# EAGLE design bldc (EAGLE 6.4)
Assembly variants: IRLR8726PBF
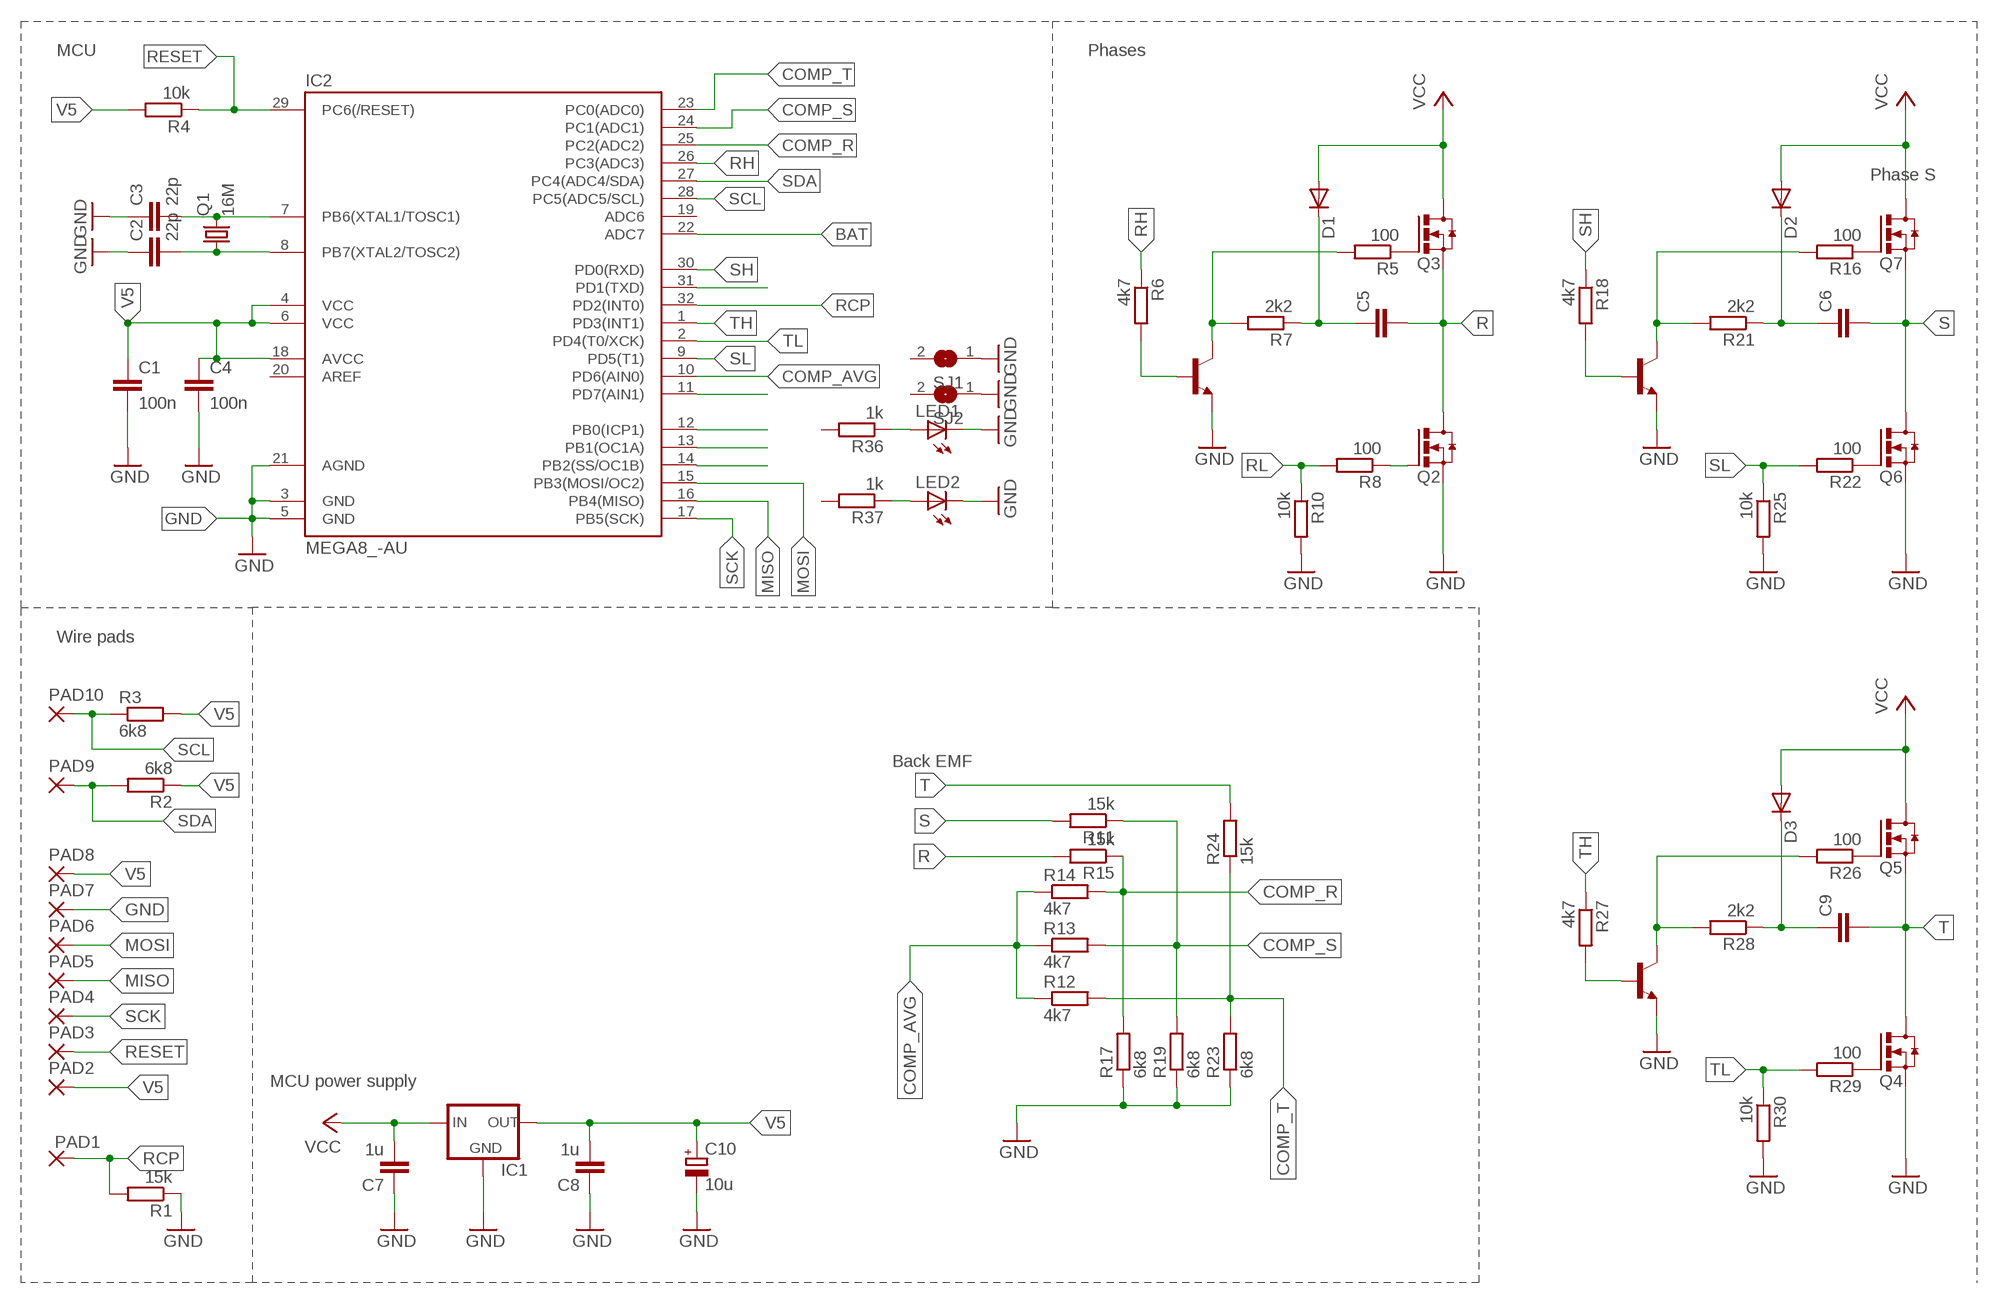
[diagram p0: schematic, sheet 1]

## Parts
C1  100n  C-EUC0805K  [C0805K]
C2  22p  C-EUC0805K  [C0805K]
C3  22p  C-EUC0805K  [C0805K]
C4  100n  C-EUC0805K  [C0805K]
C5  C-EUC1206K  [C1206K]
C6  C-EUC1206K  [C1206K]
C7  1u  C-EUC0805K  [C0805K]
C8  1u  C-EUC0805K  [C0805K]
C9  C-EUC1206K  [C1206K]
C10  10u  CPOL-EUE2.5-4V  [E2,5RE]
D1  1N4148SOD-80  [C1206K]
D2  1N4148SOD-80  [C1206K]
D3  1N4148SOD-80  [C1206K]
IC1  LM1117TO252  [TO252]
IC2  MEGA8_-AU  [TQFP32-08]
LED1  LEDCHIPLED_0805  [CHIPLED_0805]
LED2  LEDCHIPLED_0805  [CHIPLED_0805]
PAD1  WIREPADSMD1,27-254  [SMD1,27-2,54]
PAD2  WIREPADSMD1,27-254  [SMD1,27-2,54]
PAD3  WIREPADSMD1,27-254  [SMD1,27-2,54]
PAD4  WIREPADSMD1,27-254  [SMD1,27-2,54]
PAD5  WIREPADSMD1,27-254  [SMD1,27-2,54]
PAD6  WIREPADSMD1,27-254  [SMD1,27-2,54]
PAD7  WIREPADSMD1,27-254  [SMD1,27-2,54]
PAD8  WIREPADSMD1,27-254  [SMD1,27-2,54]
PAD9  WIREPADSMD1,27-254  [SMD1,27-2,54]
PAD10  WIREPADSMD1,27-254  [SMD1,27-2,54]
Q1  16M  CRYSTALSM49  [SM49]
Q2  IRFR1205  [D-PAK_TO252AA]
Q3  IRFR1205  [D-PAK_TO252AA]
Q4  IRFR1205  [D-PAK_TO252AA]
Q5  IRFR1205  [D-PAK_TO252AA]
Q6  IRFR1205  [D-PAK_TO252AA]
Q7  IRFR1205  [D-PAK_TO252AA]
R1  15k  R-EU_R0603  [R0603]
R2  6k8  R-EU_R0603  [R0603]
R3  6k8  R-EU_R0603  [R0603]
R4  10k  R-EU_R0603  [R0603]
R5  100  R-EU_R0603  [R0603]
R6  4k7  R-EU_R0603  [R0603]
R7  2k2  R-EU_R0603  [R0603]
R8  100  R-EU_R0603  [R0603]
R10  10k  R-EU_R0603  [R0603]
R11  15k  R-EU_R0603  [R0603]
R12  4k7  R-EU_R0603  [R0603]
R13  4k7  R-EU_R0603  [R0603]
R14  4k7  R-EU_R0603  [R0603]
R15  15k  R-EU_R0805  [R0805]
R16  100  R-EU_R0603  [R0603]
R17  6k8  R-EU_R0603  [R0603]
R18  4k7  R-EU_R0603  [R0603]
R19  6k8  R-EU_R0603  [R0603]
R21  2k2  R-EU_R0603  [R0603]
R22  100  R-EU_R0603  [R0603]
R23  6k8  R-EU_R0603  [R0603]
R24  15k  R-EU_R0603  [R0603]
R25  10k  R-EU_R0603  [R0603]
R26  100  R-EU_R0603  [R0603]
R27  4k7  R-EU_R0603  [R0603]
R28  2k2  R-EU_R0603  [R0603]
R29  100  R-EU_R0603  [R0603]
R30  10k  R-EU_R0603  [R0603]
R36  1k  R-EU_R0603  [R0603]
R37  1k  R-EU_R0603  [R0603]
SJ1  SJ  [SJ]
SJ2  SJ  [SJ]
T1  BC847  [SOT23]
T2  BC847  [SOT23]
T3  BC847  [SOT23]

## Nets
BAT: IC2.22(ADC7)
COMP_AVG: IC2.10(PD6(AIN0)) R12.1 R13.1 R14.1
COMP_R: IC2.25(PC2(ADC2)) R14.2 R15.1 R17.2
COMP_S: IC2.24(PC1(ADC1)) R11.1 R13.2 R19.2
COMP_T: IC2.23(PC0(ADC0)) R12.2 R23.2 R24.1
GND: C1.2 C2.1 C3.1 C4.2 C7.1 C8.1 C10.- IC1.1(GND) IC2.3(GND) IC2.5(GND) IC2.21(AGND) LED1.C LED2.C PAD7.1(P) Q2.3(S) Q4.3(S) Q6.3(S) R1.1 R10.2 R17.1 R19.1 R23.1 R25.2 R30.2 SJ1.1 SJ2.1 T1.2(E) T2.2(E) T3.2(E)
MISO: IC2.16(PB4(MISO)) PAD5.1(P)
MOSI: IC2.15(PB3(MOSI/OC2)) PAD6.1(P)
N$1: R6.2 T1.1(B)
N$2: C5.1 D1.2(C) R7.1
N$3: IC2.14(PB2(SS/OC1B))
N$4: Q3.1(G) R5.1
N$5: R5.2 R7.2 T1.3(C)
N$6: Q6.1(G) R22.1
N$7: R18.2 T2.1(B)
N$8: C6.1 D2.2(C) R21.1
N$9: Q4.1(G) R29.1
N$10: Q2.1(G) R8.1
N$11: Q7.1(G) R16.1
N$12: R16.2 R21.2 T2.3(C)
N$13: R27.2 T3.1(B)
N$14: C9.1 D3.2(C) R28.1
N$15: R26.2 R28.2 T3.3(C)
N$16: Q5.1(G) R26.1
N$17: IC2.13(PB1(OC1A))
N$18: C2.2 IC2.8(PB7(XTAL2/TOSC2)) Q1.1
N$19: C3.2 IC2.7(PB6(XTAL1/TOSC1)) Q1.2
N$20: IC2.12(PB0(ICP1))
N$21: IC2.11(PD7(AIN1))
N$25: IC2.31(PD1(TXD))
N$46: LED2.A R37.1
N$47: LED1.A R36.1
R: C5.2 Q2.4(D) Q3.3(S) R15.2
RCP: IC2.32(PD2(INT0)) PAD1.1(P) R1.2
RESET: IC2.29(PC6(/RESET)) PAD3.1(P) R4.1
RH: IC2.26(PC3(ADC3)) R6.1
RL: R8.2 R10.1
S: C6.2 Q6.4(D) Q7.3(S) R11.2
SCK: IC2.17(PB5(SCK)) PAD4.1(P)
SCL: IC2.28(PC5(ADC5/SCL)) PAD10.1(P) R3.1
SDA: IC2.27(PC4(ADC4/SDA)) PAD9.1(P) R2.2
SH: IC2.30(PD0(RXD)) R18.1
SL: IC2.9(PD5(T1)) R22.2 R25.1
T: C9.2 Q4.4(D) Q5.3(S) R24.2
TH: IC2.1(PD3(INT1)) R27.1
TL: IC2.2(PD4(T0/XCK)) R29.2 R30.1
V5: C1.1 C4.1 C8.2 C10.+ IC1.3(OUT) IC2.4(VCC) IC2.6(VCC) IC2.18(AVCC) PAD2.1(P) PAD8.1(P) R2.1 R3.2 R4.2
VCC: C7.2 D1.1(A) D2.1(A) D3.1(A) IC1.2(IN) Q3.4(D) Q5.4(D) Q7.4(D)
Unconnected: IC2.19(ADC6) IC2.20(AREF) R36.2 R37.2 SJ1.2 SJ2.2

## Notes on the sheet
- MCU | Phases
- Phase S
- Wire pads
- Back EMF
- MCU power supply

## Library data of the parts
C1-C4 C7 C8 = rcl2:C-EU: CAPACITOR, European symbol
C5 C6 C9 = rcl:C-EU: CAPACITOR, European symbol
C10 = rcl:CPOL-EU: POLARIZED CAPACITOR, European symbol
D1-D3 = 0tk:1N4148: DIODE high speed (Philips)
IC1 = v-reg-2:LM1117
IC2 = avr-4:MEGA8_
LED1 LED2 = led:LED: LED OSRAM: - CHIPLED LG R971, LG N971, LY N971, LG Q971, LY Q971, LO R971, LY R971 LH N974, LH R974 LS Q976, LO Q976, LY Q976 LO Q996 - Hyper CHIPLED LW Q18S LB Q993, LB Q99A, LB R99A - SideLED LS A670, LO A670, LY A670, LG A670, LP A670 LB A673, LV A673, LT A673, LW A673 LH A674 LY A675 LS A676, LA A676, LO A676, LY A676, LW A676 LS A679, LY A679, LG A679 - Hyper Micro SIDELED® LS Y876, LA Y876, LO Y876, LY Y876 LT Y87S - SmartLED LW L88C, LW L88S LB L89C, LB L89S, LG L890 LS L89K, LO L89K, LY L89K LS L896, LA L896, LO L896, LY L896 - TOPLED LS T670, LO T670, LY T670, LG T670, LP T670 LSG T670, LSP T670, LSY T670, LOP T670, LYG T670 LG T671, LOG T671, LSG T671 LB T673, LV T673, LT T673, LW T673 LH T674 LS T676, LA T676, LO T676, LY T676, LB T676, LH T676, LSB T676, LW T676 LB T67C, LV T67C, LT T67C, LS T67K, LO T67K, LY T67K, LW E67C LS E67B, LA E67B, LO E67B, LY E67B, LB E67C, LV E67C, LT E67C LW T67C LS T679, LY T679, LG T679 LS T770, LO T770, LY T770, LG T770, LP T770 LB T773, LV T773, LT T773, LW T773 LH T774 LS E675, LA E675, LY E675, LS T675 LS T776, LA T776, LO T776, LY T776, LB T776 LHGB T686 LT T68C, LB T68C - Hyper Mini TOPLED® LB M676 - Mini TOPLED Santana® LG M470 LS M47K, LO M47K, LY M47K Source: http://www.osram.convergy.de LUXEON: - LUMILED® LXK2-PW12-R00, LXK2-PW12-S00, LXK2-PW14-U00, LXK2-PW14-V00 LXK2-PM12-R00, LXK2-PM12-S00, LXK2-PM14-U00 LXK2-PE12-Q00, LXK2-PE12-R00, LXK2-PE12-S00, LXK2-PE14-T00, LXK2-PE14-U00 LXK2-PB12-K00, LXK2-PB12-L00, LXK2-PB12-M00, LXK2-PB14-N00, LXK2-PB14-P00, LXK2-PB14-Q00 LXK2-PR12-L00, LXK2-PR12-M00, LXK2-PR14-Q00, LXK2-PR14-R00 LXK2-PD12-Q00, LXK2-PD12-R00, LXK2-PD12-S00 LXK2-PH12-R00, LXK2-PH12-S00 LXK2-PL12-P00, LXK2-PL12-Q00, LXK2-PL12-R00 Source: www.luxeon.com KINGBRIGHT: KA-3528ASYC Source: www.kingbright.com
PAD1-PAD10 = wirepad:WIREPAD: Wire PAD connect wire on PCB
Q1 = crystal:CRYSTAL: CRYSTAL; OC_FARNELL: unknown; OC_NEWARK: unknown
Q2-Q7 = transistor-power:IRFR1205
R1-R8 R10-R14 R16-R19 R21-R30 R36 R37 = resistor:R-EU_: RESISTOR, European symbol
R15 = rcl2:R-EU_: RESISTOR, European symbol
SJ1 SJ2 = jumper:SJ: SMD solder JUMPER
T1-T3 = transistor2:BC847: NPN TRANSISTOR

## Board
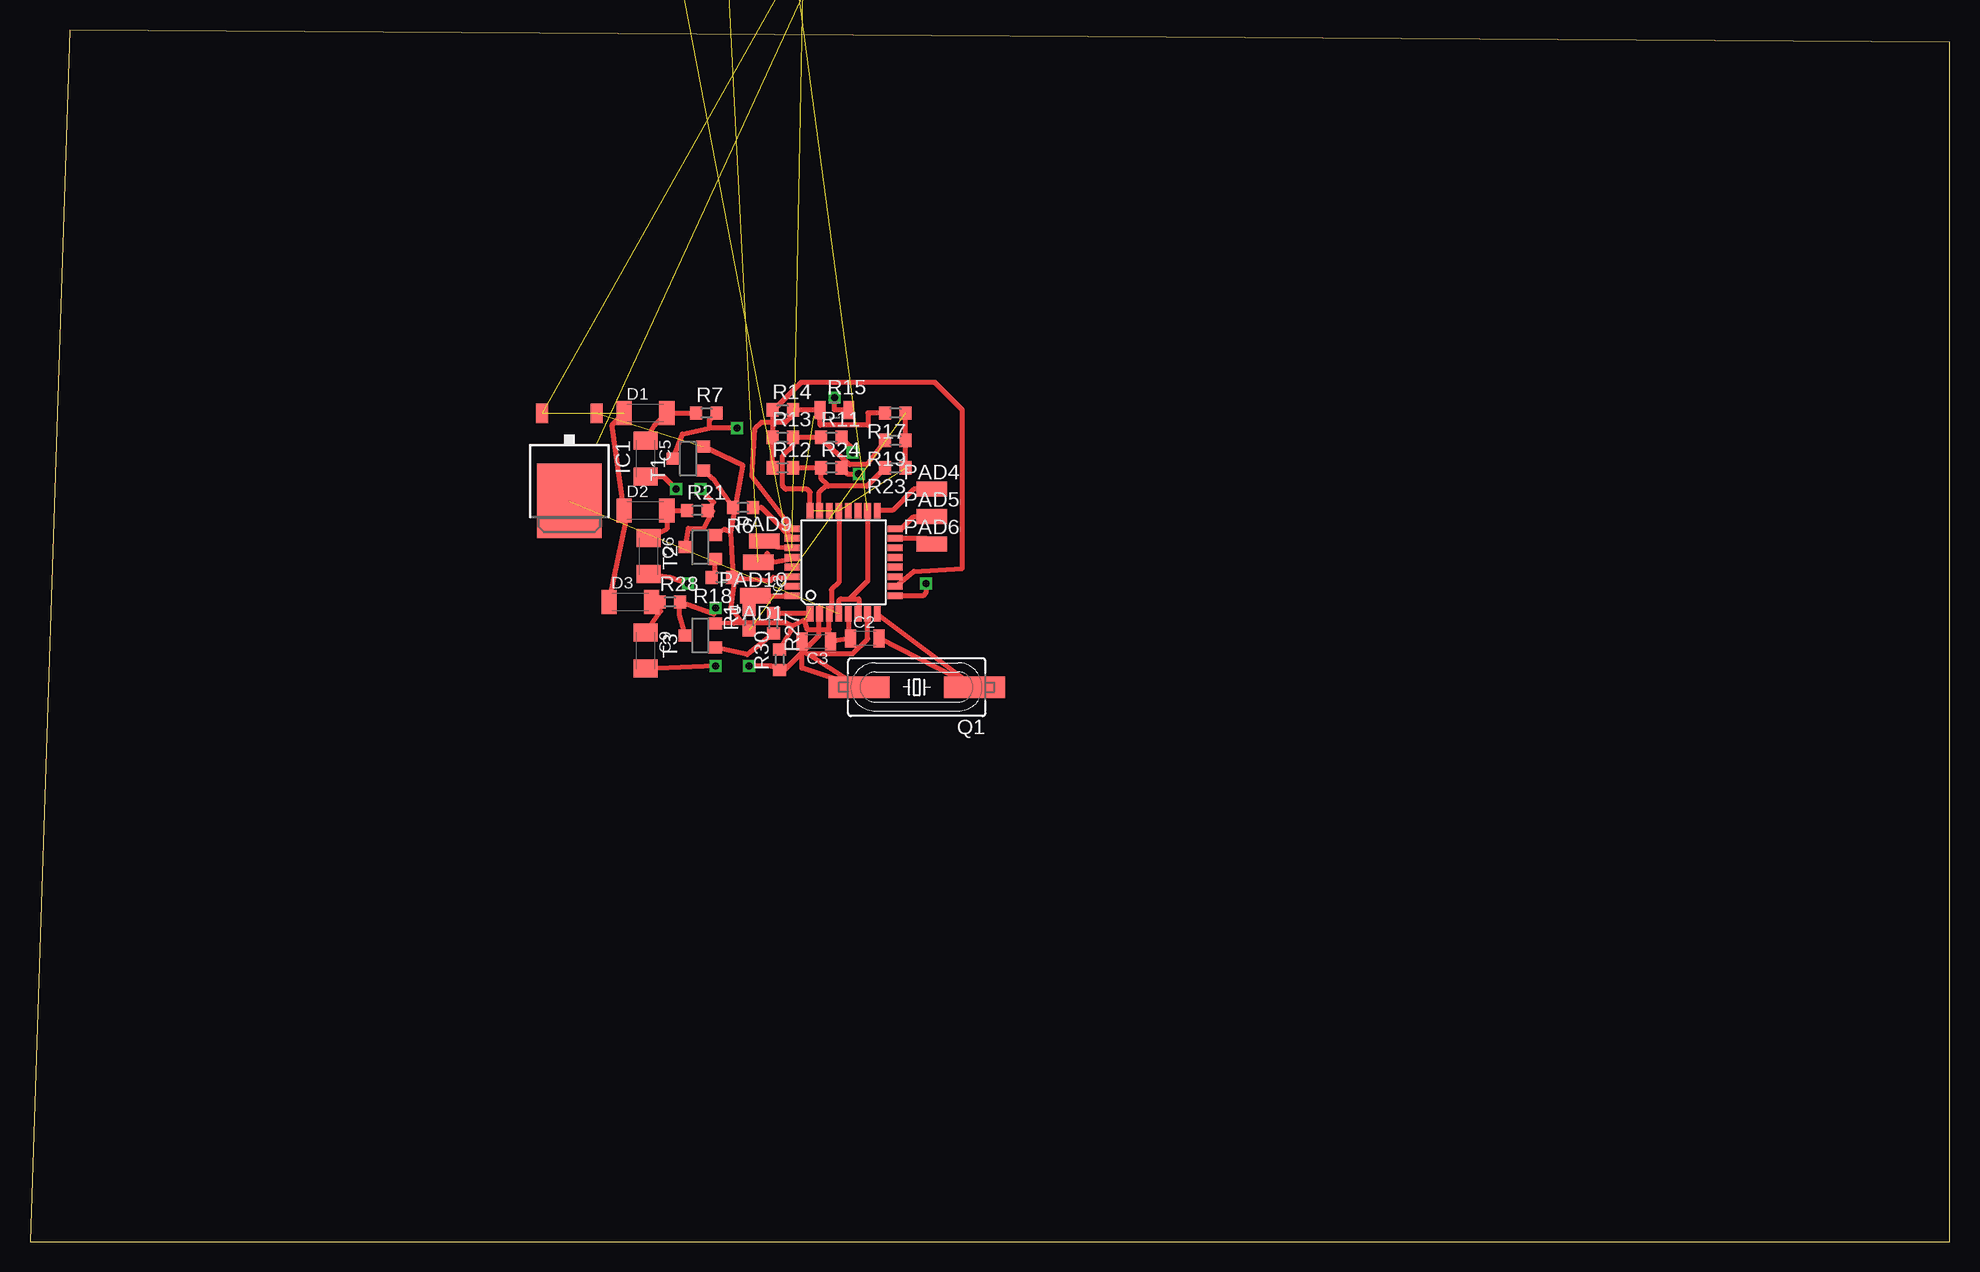
[diagram p1: board, top side]
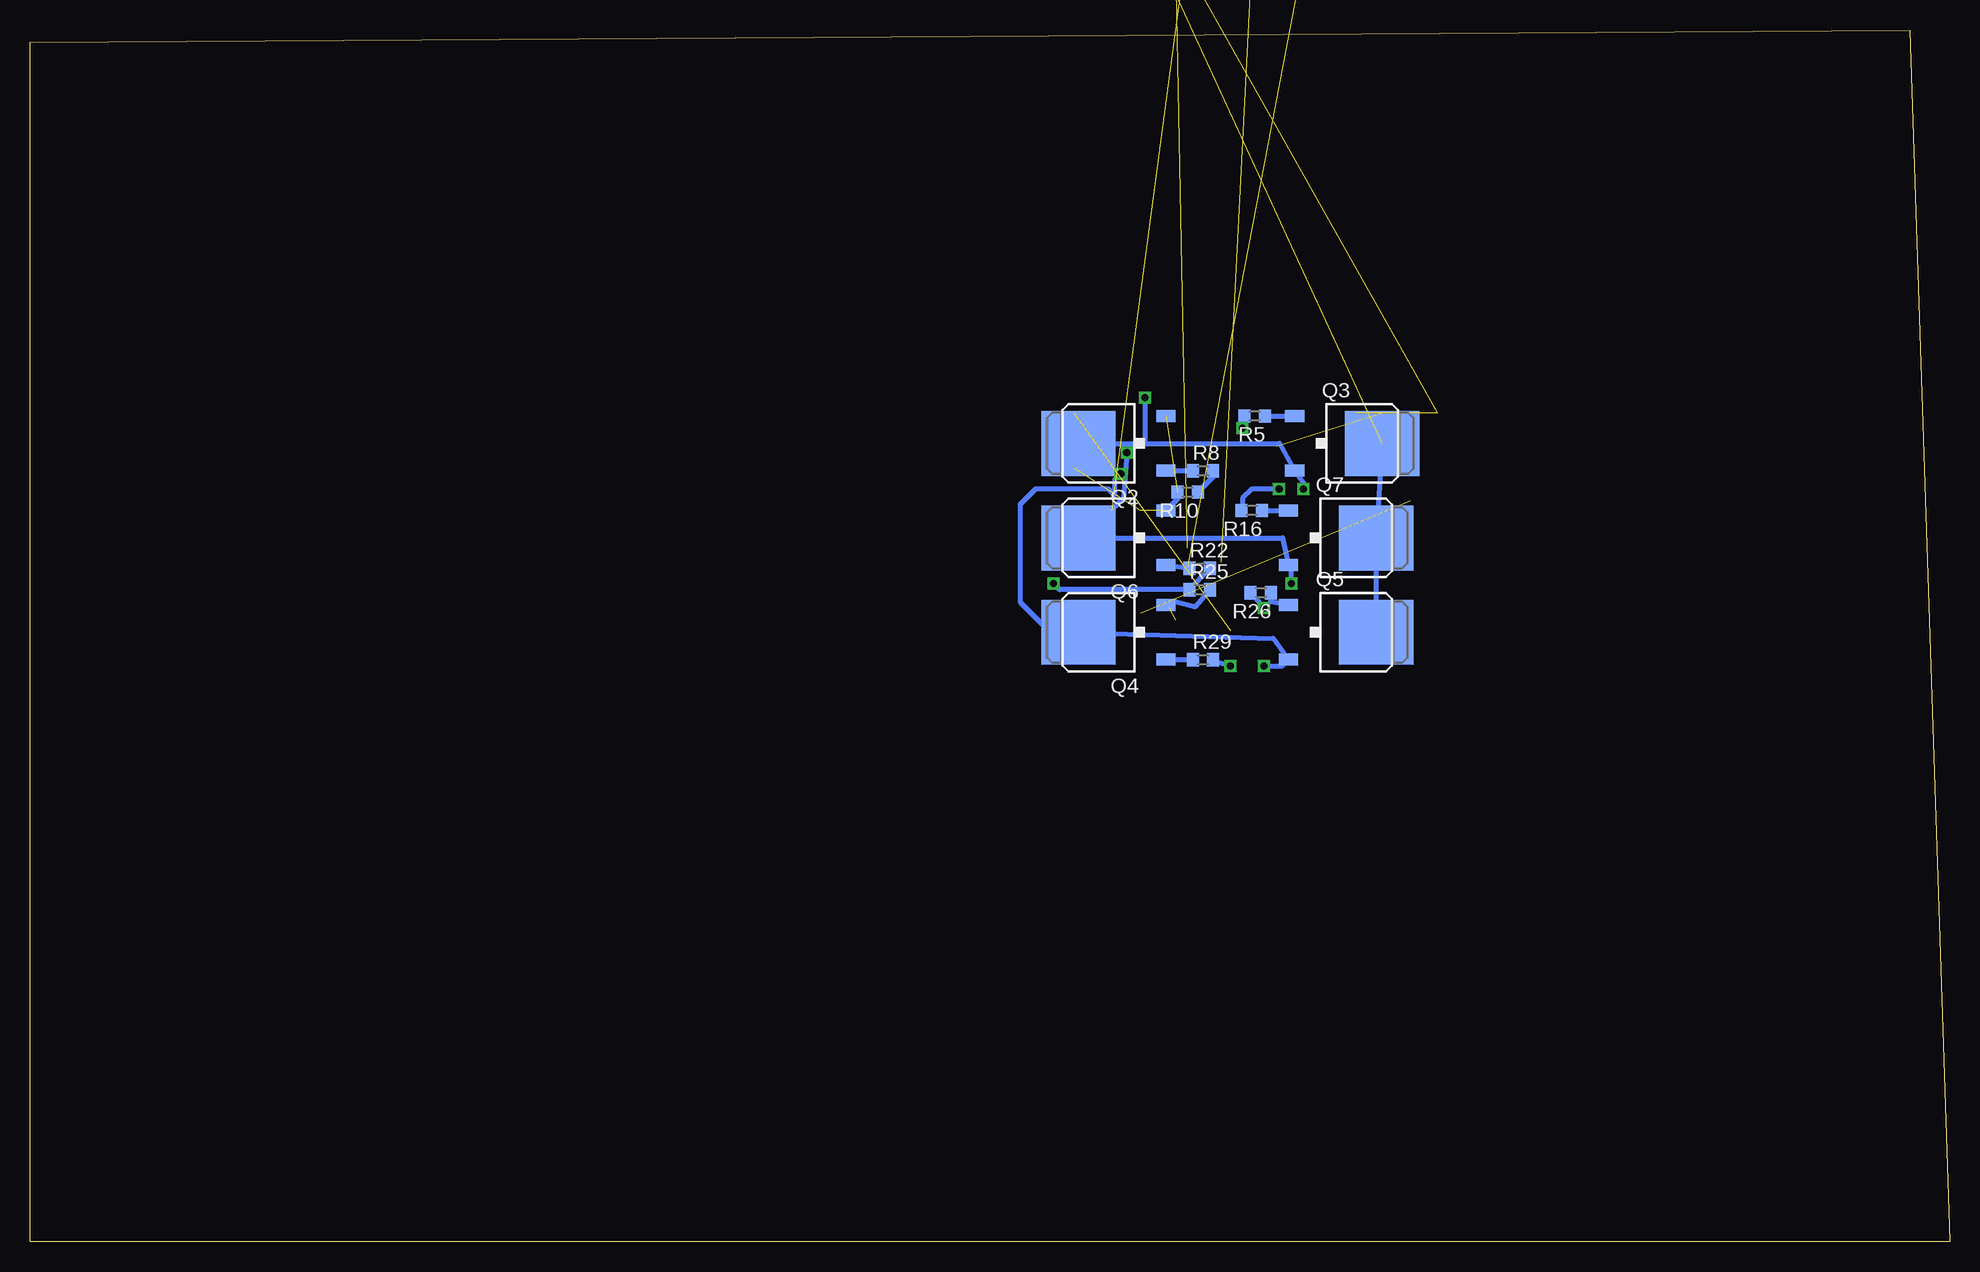
[diagram p2: board, bottom side, seen from below]

Size 160 x 101.02 mm. Coordinates in mm from the lower left corner, seen from the top.
Outline: 0,0 160,0 160,100 3.3,101.02 0,0
Copper layers (1*16): Top 0.035mm / dielectric 1.5mm / Bottom 0.035mm
Design rules "default": minimum track width 10mil, minimum drill 24mil, track to track 8mil, track to pad 8mil, pad to pad 8mil, via to via 8mil, smd to smd 8mil, copper to edge 40mil, drill to drill 8mil, minimum pad ring 10mil, minimum via ring 8mil, stop-mask expansion 4mil, vias tented up to drill 0mil, thermal gap 10mil

### Footprints (pad centres in the part's own frame; a part is rotated, then mirrored left to right if it is on the bottom)
C0805K = smd 0.914 x 1.5: 1 -1.194,0; 2 1.194,0
C1206K = smd 1.5 x 2: 1 -1.5,0; 2 1.5,0
E2,5RE = drill 0.813 pad 1.575: + -1.27,0 | drill 0.813 pad 1.575 octagon: - 1.27,0
C1206K' = smd 1.27 x 2: 1 -1.778,0; 2 1.778,0
TO252 = smd 1 x 1.6: 1 -2.28,-6.07; 2 2.28,-6.07 | smd 5.4 x 6.2: 3 0,1.23
TQFP32-08 = smd 1.27 x 0.559: 1 -4.293,2.8; 2 -4.293,2; 3 -4.293,1.2; 4 -4.293,0.4; 5 -4.293,-0.4; 6 -4.293,-1.2; 7 -4.293,-2; 8 -4.293,-2.8; 17 4.293,-2.8; 18 4.293,-2; 19 4.293,-1.2; 20 4.293,-0.4; 21 4.293,0.4; 22 4.293,1.2; 23 4.293,2; 24 4.293,2.8 | smd 0.559 x 1.27: 9 -2.8,-4.293; 10 -2,-4.293; 11 -1.2,-4.293; 12 -0.4,-4.293; 13 0.4,-4.293; 14 1.2,-4.293; 15 2,-4.293; 16 2.8,-4.293; 25 2.8,4.293; 26 2,4.293; 27 1.2,4.293; 28 0.4,4.293; 29 -0.4,4.293; 30 -1.2,4.293; 31 -2,4.293; 32 -2.8,4.293
CHIPLED_0805 = smd 1.2 x 1.2: A 0,-1.05; C 0,1.05
SMD1,27-2,54 = smd 1.27 x 2.54: 1 0,0
SM49 = smd 5.08 x 1.778: 1 -4.826,0; 2 4.826,0
D-PAK_TO252AA = smd 1 x 1.6: 1 -2.28,-4.8; 3 2.28,-4.8 | smd 5.4 x 6.2: 4 0,2.5
R0603 = smd 1 x 1.1: 1 -0.85,0; 2 0.85,0
R0805 = smd 0.914 x 1.5: 1 -1.194,0; 2 1.194,0
SJ = smd 1.168 x 1.6: 1 -0.762,0; 2 0.762,0
SOT23 = smd 1 x 1.143: 1 -0.991,-1.245; 2 0.991,-1.245; 3 0,1.245

### Placement (x,y rotation side)
C1  40.89,119.38 0 top  (outside the outline)
C2  69.6,50.29 0 top
C3  65.53,50.04 180 top
C4  84.07,124.46 0 top  (outside the outline)
C5  51.31,65.28 270 top
C6  51.56,57.15 270 top
C7  72.64,124.46 0 top  (outside the outline)
C8  68.83,124.46 0 top  (outside the outline)
C9  51.31,49.28 270 top
C10  40.89,113.03 0 top  (outside the outline)
D1  1N4148SOD-80  [C1206K']  51.31,69.09 0 top
D2  1N4148SOD-80  [C1206K']  51.31,60.96 0 top
D3  1N4148SOD-80  [C1206K']  50.04,53.34 0 top
IC1  44.96,62.99 180 top
IC2  67.82,56.64 90 top
LED1  52.32,118.11 0 top  (outside the outline)
LED2  47.24,118.11 0 top  (outside the outline)
PAD1  60.45,53.85 90 top
PAD2  82.8,119.38 0 top  (outside the outline)
PAD3  78.99,119.38 0 top  (outside the outline)
PAD4  75.18,62.74 270 top
PAD5  75.18,60.45 270 top
PAD6  75.18,58.17 270 top
PAD7  63.75,119.38 0 top  (outside the outline)
PAD8  59.94,119.38 0 top  (outside the outline)
PAD9  61.21,58.42 270 top
PAD10  60.71,56.64 90 top
Q1  73.91,46.23 180 top
Q2  70.1,66.55 90 bottom
Q3  49.78,66.55 270 bottom
Q4  70.1,50.8 90 bottom
Q5  50.29,50.8 270 bottom
Q6  70.1,58.67 90 bottom
Q7  50.29,58.67 270 bottom
R1  59.94,51.82 90 top
R2  63.75,113.03 0 top  (outside the outline)
R3  58.67,113.03 0 top  (outside the outline)
R4  53.59,113.03 0 top  (outside the outline)
R5  57.91,68.83 180 bottom
R6  59.44,61.21 180 top
R7  56.39,69.09 0 top
R8  62.23,64.26 0 bottom
R10  63.5,62.48 180 bottom
R11  66.8,67.06 0 top
R12  62.74,64.52 0 top
R13  62.74,67.06 0 top
R14  62.74,69.34 0 top
R15  67.06,69.34 0 top
R16  58.17,60.96 180 bottom
R17  72.14,69.09 180 top
R18  57.66,55.37 180 top
R19  72.14,66.8 180 top
R21  55.63,60.96 0 top
R22  62.48,56.13 0 bottom
R23  72.14,64.52 180 top
R24  66.8,64.52 0 top
R25  62.48,54.36 0 bottom
R26  57.4,54.1 180 bottom
R27  61.98,51.56 270 top
R28  53.34,53.34 0 top
R29  62.23,48.51 0 bottom
R30  62.48,48.51 90 top
R36  52.32,106.68 0 top  (outside the outline)
R37  47.24,105.92 0 top  (outside the outline)
SJ1  65.02,123.19 0 top  (outside the outline)
SJ2  61.21,127.25 0 top  (outside the outline)
T1  54.86,65.28 90 top
T2  55.88,57.91 90 top
T3  55.88,50.55 90 top

### Tracks (layer width: path | path; a pad name or v marks a point on that pad's centre or on a via)
COMP_AVG
  Top 0.406: R12.1 R13.1 R14.1 61.98,69.34 64.26,71.63 75.44,71.63 77.72,69.34 77.72,56.13 73.66,55.88 72.14,54.61 IC2.10
COMP_R
  Top 0.406: R17.2 69.85,69.09 69.85,68.07 65.86,68.07 R15.1 R14.2 63.59,68.92 62.99,68.33 60.96,68.33 60.45,67.82 60.2,63.78 IC2.25
COMP_S
  Top 0.406: R19.2 69.76,64.77 68.33,64.77 65.95,66.89 R11.1 R13.2 63.59,66.38 62.74,65.53 62.74,62.99 62.99,62.74 64.77,62.74 65.02,62.48 65.02,60.94 IC2.24
COMP_T
  Top 0.406: R12.2 R24.1 65.95,63.59 66.42,63.12 | R23.2 69.76,62.99 66.55,62.99 66.42,63.12 | IC2.23 65.79,60.97 65.79,62.48 66.42,63.12
GND  (15 unrouted)
  Top 0.406: R23.1 R19.1 R17.1 | 66.62,51.05 66.62,50.4 C3.1 C2.1 68.22,50.48 IC2.5 | 66.62,51.05 IC2.3 66.8,52.53 66.8,54.36 67.42,54.97 IC2.21 | 58.42,59.18 58.67,54.61 58.42,52.83 59.18,51.81 58.67,51.56 | 58.42,59.18 59.44,64.72 T1.2 | T2.2 57.89,59.41 58.42,59.18 | R30.2 63.41,50.89 63.5,51.31 | 63.5,51.31 62.99,51.56 59.94,51.56 | 59.94,51.56 58.67,51.56 | 58.67,51.56 T3.2 | 63.5,51.31 64.52,51.82 64.77,51.05 66.62,51.05 | R1.1 60.03,50.97 | 60.03,50.97 60.2,50.8 | 60.03,50.97 59.94,51.05 59.94,51.56 | 59.94,51.56
  Bottom 0.406: R25.2 62.9,52.92 64.52,53.34 65.06,52.83 Q4.3 | R10.2 64.35,61.91 Q6.3
MISO
  Top 0.406: IC2.16 72.65,59.44 73.66,60.45 PAD5.1
MOSI
  Top 0.406: IC2.15 74.71,58.64 PAD6.1
N$1
  Top 0.406: R6.2 57.06,63.46 T1.1
N$2
  Top 0.406: C5.1 52.07,68.07 D1.2 R7.1
N$4
  Bottom 0.406: R5.1 54.84,68.83 Q3.1
N$5  (via drill 0.6)
  Top 0.406: T1.3 54.38,67.33 56.64,67.82 | 56.64,67.82 56.64,68.49 R7.2 | v58.93,67.82 56.64,67.82
  Bottom 0.406: R5.2 58.76,67.98 v58.93,67.82
N$6
  Bottom 0.406: R22.1 Q6.1
N$7
  Top 0.406: R18.2 57.1,55.37 T2.1
N$8
  Top 0.406: C6.1 53.09,59.41 D2.2 R21.1
N$9
  Bottom 0.406: Q4.1 R29.1
N$10
  Bottom 0.406: Q2.1 R8.1
N$11
  Bottom 0.406: R16.1 Q7.1
N$12  (via drill 0.6)
  Top 0.406: v55.88,62.74 56.98,61.63 R21.2 56.9,60.87 56.13,59.44 54.89,59.46 T2.3
  Bottom 0.406: v55.88,62.74 58.17,62.74 58.93,61.98 58.93,61.05 R16.2
N$13
  Top 0.406: R27.2 59.8,48.93 T3.1
N$14
  Top 0.406: R28.1 D3.2 52.58,52.58 C9.1
N$15  (via drill 0.6)
  Top 0.406: T3.3 54.13,52.26 R28.2 56.98,52.32 v57.15,52.83
  Bottom 0.406: R26.2 v57.15,52.83
N$16
  Bottom 0.406: Q5.1 56.55,53.33 R26.1
N$18
  Top 0.406: IC2.8 70.62,52.32 Q1.1 70.87,50.29 C2.2
N$19
  Top 0.406: IC2.7 69.82,50.26 68.58,49.02 64.77,49.02 Q1.2 64.34,47.83 C3.2
N$46  (1 unrouted)
N$47  (1 unrouted)
R  (via drill 0.6)
  Top 0.406: R15.2 67.06,69.34 v67.06,70.36 | C5.2 52.81,63.78 v53.85,62.74
  Bottom 0.406: Q2.4 67.06,66.55 | 67.06,66.55 55.85,66.55 Q3.3 53.85,63.28 v53.85,62.74 | v67.06,70.36 67.06,66.55
RCP
  Top 0.406: IC2.32 63.52,53.85 PAD1.1 59.94,53.34 R1.2
RESET  (2 unrouted)
RH
  Top 0.406: R6.1 60.96,61.21 62.74,59.44 62.74,59.43 IC2.26
RL
  Bottom 0.406: R8.2 61.38,63.75 R10.1
S  (via drill 0.6)
  Top 0.406: R11.2 68.83,65.87 v68.58,65.79 | C6.2 53.32,55.4 v54.86,54.86
  Bottom 0.406: v68.58,65.79 68.83,61.98 72.14,58.67 Q6.4 55.6,58.67 Q7.3 54.86,56.17 v54.86,54.86
SCK
  Top 0.406: PAD4.1 73.66,62.74 71.88,60.96 70.64,60.96 IC2.17
SCL  (1 unrouted)
  Top 0.406: PAD10.1 60.96,56.39 61.47,57.4 61.47,57.15 61.98,56.64 63.38,56.9 IC2.28
SDA  (1 unrouted)
  Top 0.406: PAD9.1 62.33,57.91 IC2.27
SH
  Top 0.406: R18.1 61.72,55.12 61.98,55.37 63.45,55.37 IC2.30
SL  (via drill 0.6)
  Top 0.406: v74.68,54.86 74.68,54.1 74.42,53.85 IC2.9
  Bottom 0.406: R22.2 R25.1 74.17,54.36 v74.68,54.86
T  (via drill 0.6)
  Top 0.406: R24.2 68.16,64.01 v69.09,64.01 | C9.2 57.13,48.03 v57.15,48.01
  Bottom 0.406: v69.09,64.01 69.6,63.5 69.6,62.23 70.1,62.74 76.2,62.74 77.47,61.47 77.47,53.34 74.93,50.8 Q4.4 56.36,50.29 Q5.3 55.61,48.01 v57.15,48.01
TH
  Top 0.406: R27.1 64.95,52.41 IC2.1
TL  (via drill 0.6)
  Top 0.406: v59.94,48.01 61.72,48.01 R30.1 62.9,47.66 65.79,50.55 65.79,52.32 IC2.2
  Bottom 0.406: v59.94,48.01 61.47,48.43 R29.2
V5  (10 unrouted)
  Top 0.406: IC2.4 67.42,53.45 67.56,53.59 68.33,53.59 | 68.33,53.59 69.09,53.59 69.09,52.42 IC2.6 | IC2.18 69.82,55.09 68.33,53.59
VCC  (3 unrouted)
  Top 0.406: D1.1 48.51,68.07 D2.1 49.78,60.45 D3.1
  Bottom 0.406: Q3.4 Q7.4 Q5.4